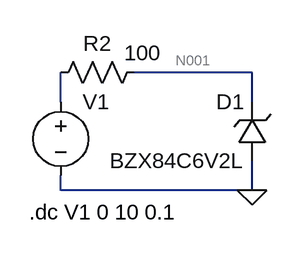
[diagram p0: schematic Zener_Diode.asc]
Zener_Diode.asc, the LTspice schematic file:
Version 4
SHEET 1 880 680
WIRE 208 112 80 112
WIRE 0 144 0 112
WIRE 208 144 208 112
WIRE 0 240 0 224
WIRE 208 240 208 208
WIRE 208 240 0 240
FLAG 208 240 0
SYMBOL zener 224 208 R180
WINDOW 0 24 64 Left 2
WINDOW 3 24 0 Left 2
SYMATTR InstName D1
SYMATTR Value BZX84C6V2L
SYMATTR Description Diode
SYMATTR Type diode
SYMBOL res 96 96 R90
WINDOW 0 0 56 VBottom 2
WINDOW 3 -21 7 VTop 2
SYMATTR InstName R2
SYMATTR Value 100
SYMBOL voltage 0 128 R0
WINDOW 123 0 0 Left 2
WINDOW 39 0 0 Left 2
SYMATTR InstName V1
SYMATTR Value ""
TEXT -34 264 Left 2 !.dc V1 0 10 0.1

The netlist it stands for:
* Zener_Diode.asc
D1 0 N001 BZX84C6V2L
R2 N001 N002 100
V1 N002 0
.model D D
.lib standard.dio
.dc V1 0 10 0.1
.backanno
.end

* Results of the author's LTspice run, read from the files saved beside the schematic
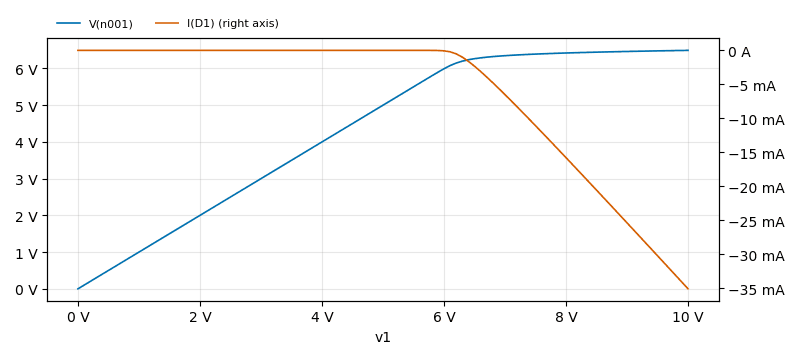
[diagram p1: DC transfer characteristic of Zener_Diode.asc, plotted from the saved traces]
* DC transfer characteristic, 1 run:
*   V(n001): 0 V at v1=0 V, 6.494 V at v1=10 V, min 0 V, max 6.494 V
*   I(D1): 0 A at v1=0 V, -35.06 mA at v1=10 V, min -35.06 mA, max 0 A